# EAGLE schematic dx10lm1-14se-to-ml-14p-cross (EAGLE 9.1.0)
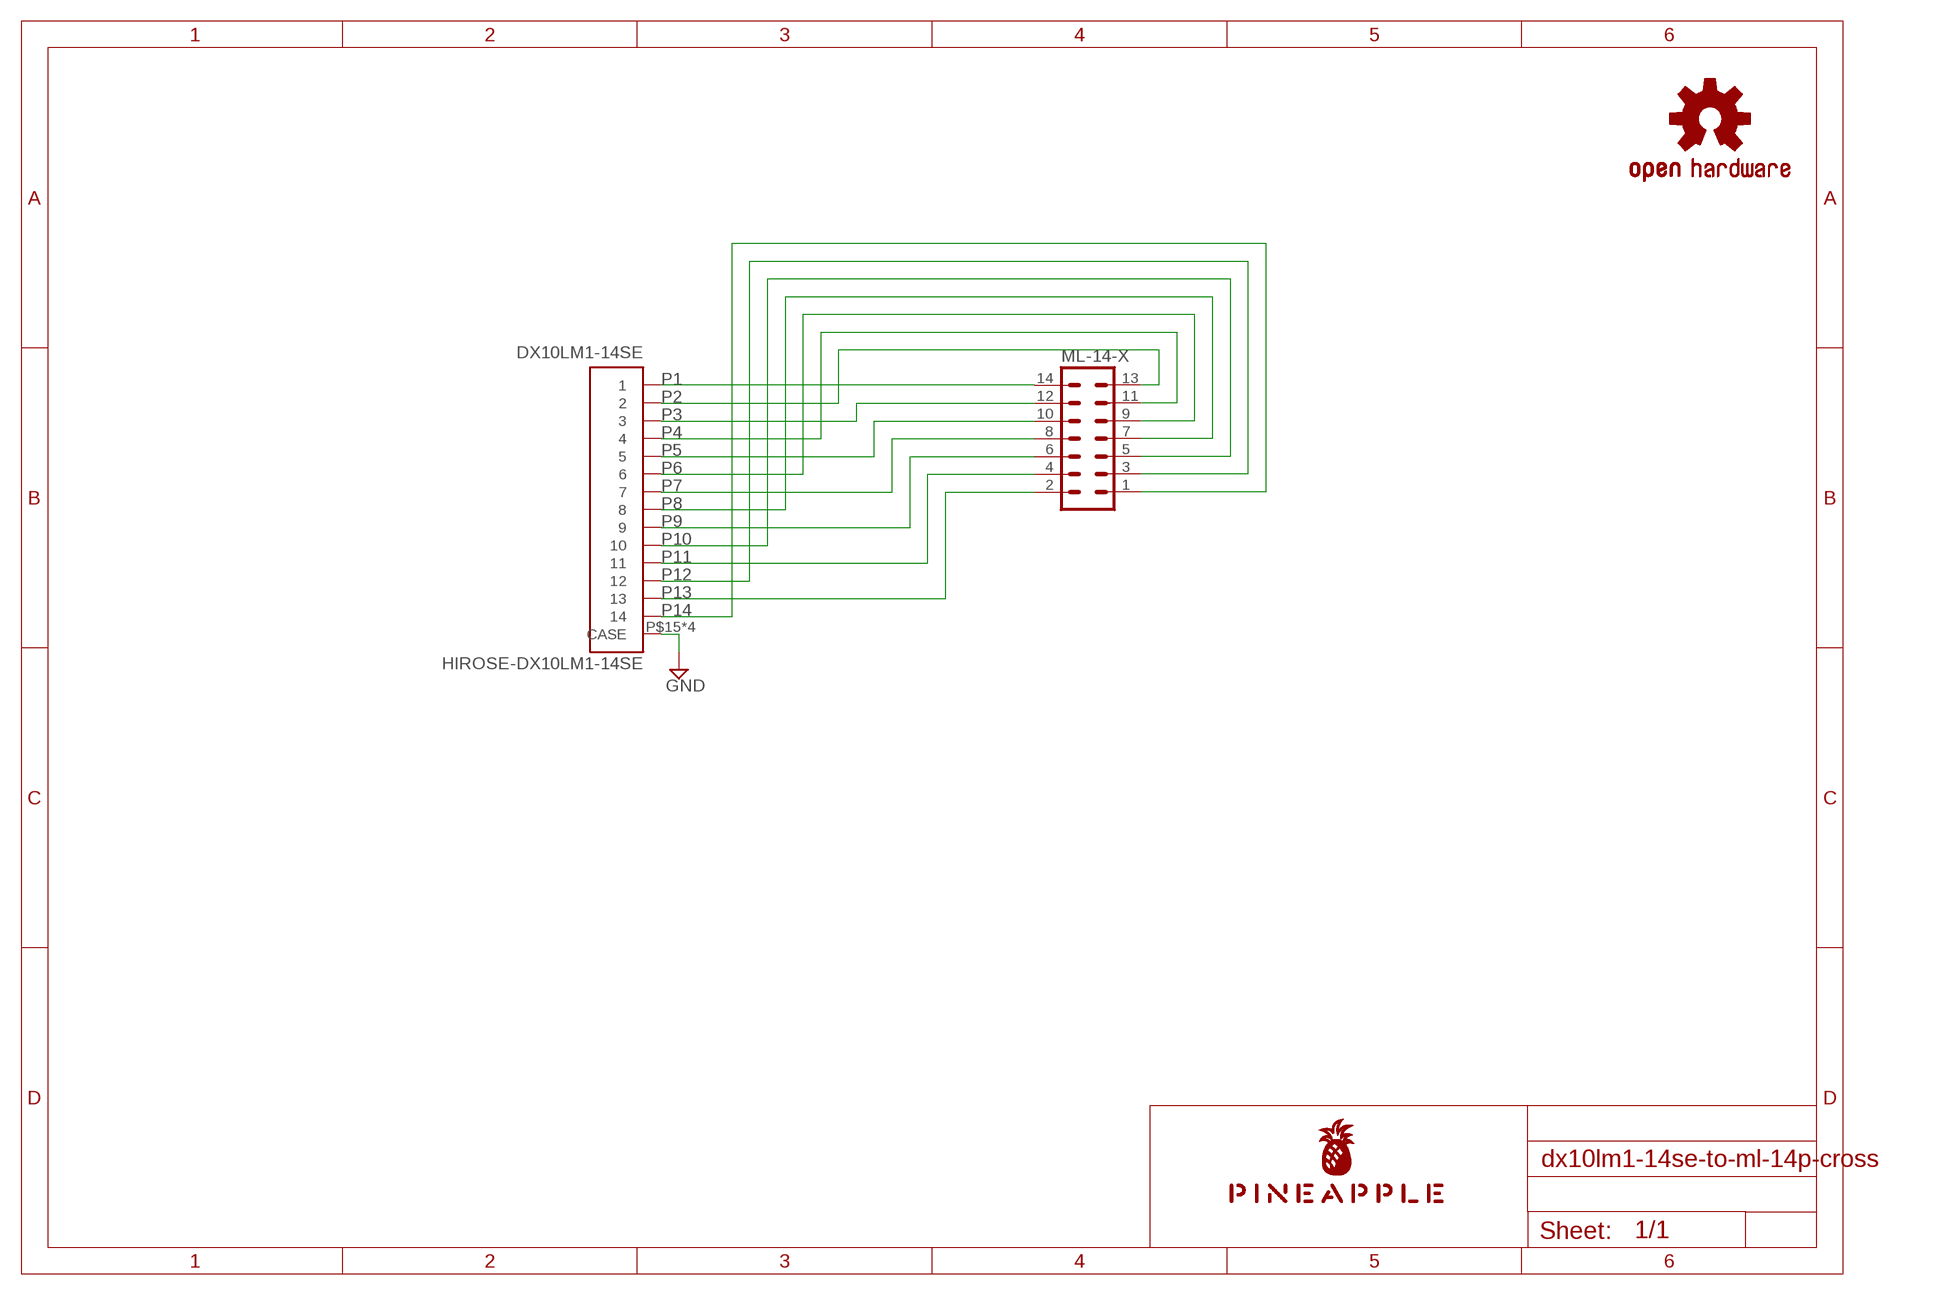
[diagram p0: schematic, sheet 1]

## Parts
DX10LM1-14SE  HIROSE-DX10LM1-14SE  [HIROSE-DX10LM1-14SE]
LOGO1  OSHW-LOGOS-COPPER  [OSHW-LOGO-S_COPPER]
ML-14-X  ML14L  [ML14L]
U$1  PINEAPPLE450_SILK  [PINEAPPLE450_SILK]

## Nets
GND: DX10LM1-14SE.P$15(CASE) DX10LM1-14SE.P$16(CASE) DX10LM1-14SE.P$17(CASE) DX10LM1-14SE.P$18(CASE)
P1: DX10LM1-14SE.P$1 ML-14-X.14
P2: DX10LM1-14SE.P$2 ML-14-X.13
P3: DX10LM1-14SE.P$3 ML-14-X.12
P4: DX10LM1-14SE.P$4 ML-14-X.11
P5: DX10LM1-14SE.P$5 ML-14-X.10
P6: DX10LM1-14SE.P$6 ML-14-X.9
P7: DX10LM1-14SE.P$7 ML-14-X.8
P8: DX10LM1-14SE.P$8 ML-14-X.7
P9: DX10LM1-14SE.P$9 ML-14-X.6
P10: DX10LM1-14SE.P$10 ML-14-X.5
P11: DX10LM1-14SE.P$11 ML-14-X.4
P12: DX10LM1-14SE.P$12 ML-14-X.3
P13: DX10LM1-14SE.P$13 ML-14-X.2
P14: DX10LM1-14SE.P$14 ML-14-X.1

## Library data of the parts
DX10LM1-14SE = con-hirose-dx10lm1-14se:HIROSE-DX10LM1-14SE: HIROSE DX10LM1-14SE
LOGO1 = SparkFun-Aesthetics:OSHW-LOGO: Open-Source Hardware (OSHW) Logo This logo indicates the piece of hardware it is found on incorporates a OSHW license and/or adheres to the definition of open source hardware found here: http://freedomdefined.org/OSHW
ML-14-X = con-ml:ML14L: HARTING; OC_FARNELL: unknown; OC_NEWARK: unknown
U$1 = pineapple:PINEAPPLE450_SILK

## Net classes
0 default: width 0.305 mm, drill 0.152 mm, clearance 0.152 mm